# EAGLE design tqfp-sandwich-rf (EAGLE 9.6.2)

## Sheet 1 of 2
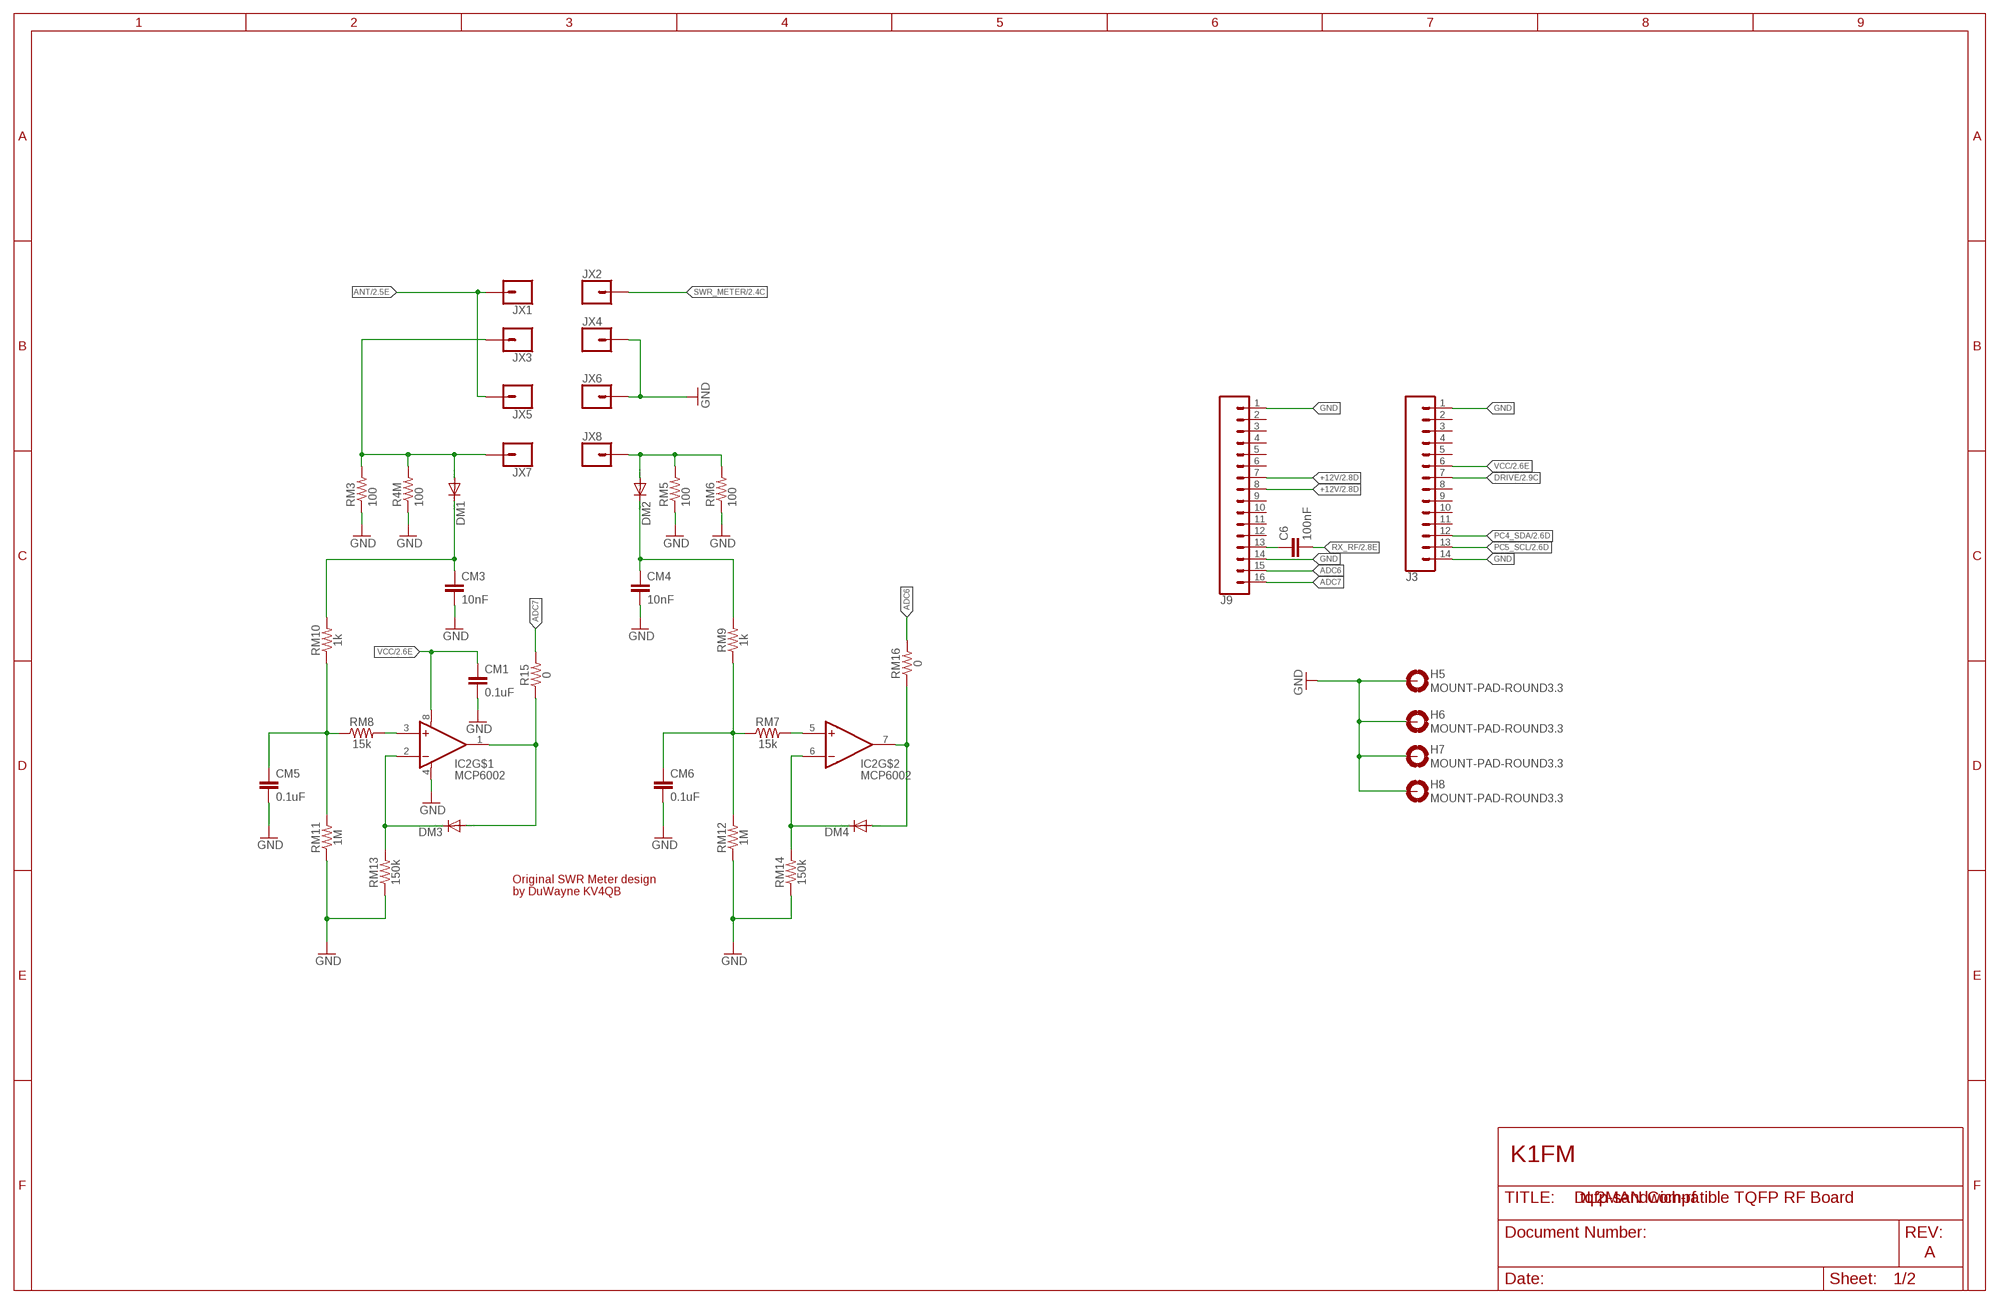
[diagram p0: schematic, sheet 1]

### Parts
C6  100nF  CAPACITOR_0805_L  [RESC0805_L]
CM1  0.1uF  0.1UF-0603-100V-10%  [0603]
CM3  10nF  10NF-0603-50V-10%  [0603]
CM4  10nF  10NF-0603-50V-10%  [0603]
CM5  0.1uF  0.1UF-0603-100V-10%  [0603]
CM6  0.1uF  0.1UF-0603-100V-10%  [0603]
DM1  1N60P  1N4148DO35-10  [DO35-10]
DM2  1N60P  1N4148DO35-10  [DO35-10]
DM3  1N60P  1N4148DO35-10  [DO35-10]
DM4  1N60P  1N4148DO35-10  [DO35-10]
H5  MOUNT-PAD-ROUND3.3  [3,3-PAD]
H6  MOUNT-PAD-ROUND3.3  [3,3-PAD]
H7  MOUNT-PAD-ROUND3.3  [3,3-PAD]
H8  MOUNT-PAD-ROUND3.3  [3,3-PAD]
IC2  MCP6002  MCP6293  [SOIC8]
J3  CONN_14  [1X14]
J9  CONN_16  [1X16]
JX1  CONN_01  [1X01]
JX2  CONN_01  [1X01]
JX3  CONN_01  [1X01]
JX4  CONN_01  [1X01]
JX5  CONN_01  [1X01]
JX6  CONN_01  [1X01]
JX7  CONN_01  [1X01]
JX8  CONN_01  [1X01]
R4M  100  R-US_M1206  [M1206]
R15  0  1KOHM-0603-1/10W-1%  [0603]
RM3  100  R-US_M1206  [M1206]
RM5  100  R-US_M1206  [M1206]
RM6  100  R-US_M1206  [M1206]
RM7  15k  15KOHM-0603-1/10W-1%  [0603]
RM8  15k  15KOHM-0603-1/10W-1%  [0603]
RM9  1k  1KOHM-0603-1/10W-1%  [0603]
RM10  1k  1KOHM-0603-1/10W-1%  [0603]
RM11  1M  1MOHM-0603-1/4W-5%  [0603]
RM12  1M  1MOHM-0603-1/4W-5%  [0603]
RM13  150k  150KOHM-0603-1/10W-1%  [0603]
RM14  150k  150KOHM-0603-1/10W-1%  [0603]
RM16  0  1KOHM-0603-1/10W-1%  [0603]

### Nets
+12V: J9.7 J9.8 ; also sheet 2
ADC6: J9.15 RM16.2
ADC7: J9.16 R15.2
ANT: JX1.1 JX5.1 ; also sheet 2
DRIVE: J3.7 ; also sheet 2
GND: CM1.2 CM3.2 CM4.2 CM5.2 CM6.2 H5.B3,3(MOUNT) H6.B3,3(MOUNT) H7.B3,3(MOUNT) H8.B3,3(MOUNT) IC2.4(V-) J3.1 J3.14 J9.1 J9.14 JX4.1 JX6.1 R4M.1 RM3.1 RM5.1 RM6.1 RM11.1 RM12.1 RM13.1 RM14.1 ; also sheet 2
N$5: DM3.A IC2.1(OUT) R15.1
N$6: DM4.A IC2.7(OUT) RM16.1
N$8: C6.1 J9.13
N$9: DM1.A JX3.1 JX7.1 R4M.2 RM3.2
N$10: DM2.A JX8.1 RM5.2 RM6.2
N$12: CM3.1 DM1.C RM10.2
N$13: CM4.1 DM2.C RM9.2
N$16: DM3.C IC2.2(-IN) RM13.2
N$17: DM4.C IC2.6(-IN) RM14.2
N$19: IC2.3(+IN) RM8.2
N$20: IC2.5(+IN) RM7.2
N$21: CM6.1 RM7.1 RM9.1 RM12.2
N$22: CM5.1 RM8.1 RM10.1 RM11.2
PC4_SDA: J3.12 ; also sheet 2
PC5_SCL: J3.13 ; also sheet 2
RX_RF: C6.2 ; also sheet 2
SWR_METER: JX2.1 ; also sheet 2
VCC: CM1.1 IC2.8(V+) J3.6 ; also sheet 2
Unconnected: J3.2 J3.3 J3.4 J3.5 J3.8 J3.9 J3.10 J3.11 J9.2 J9.3 J9.4 J9.5 J9.6 J9.9 J9.10 J9.11 J9.12

### Notes on the sheet
- Original SWR Meter design
  by DuWayne KV4QB
- K1FM
- DL2MAN Compatible TQFP RF Board
- A

## Sheet 2 of 2
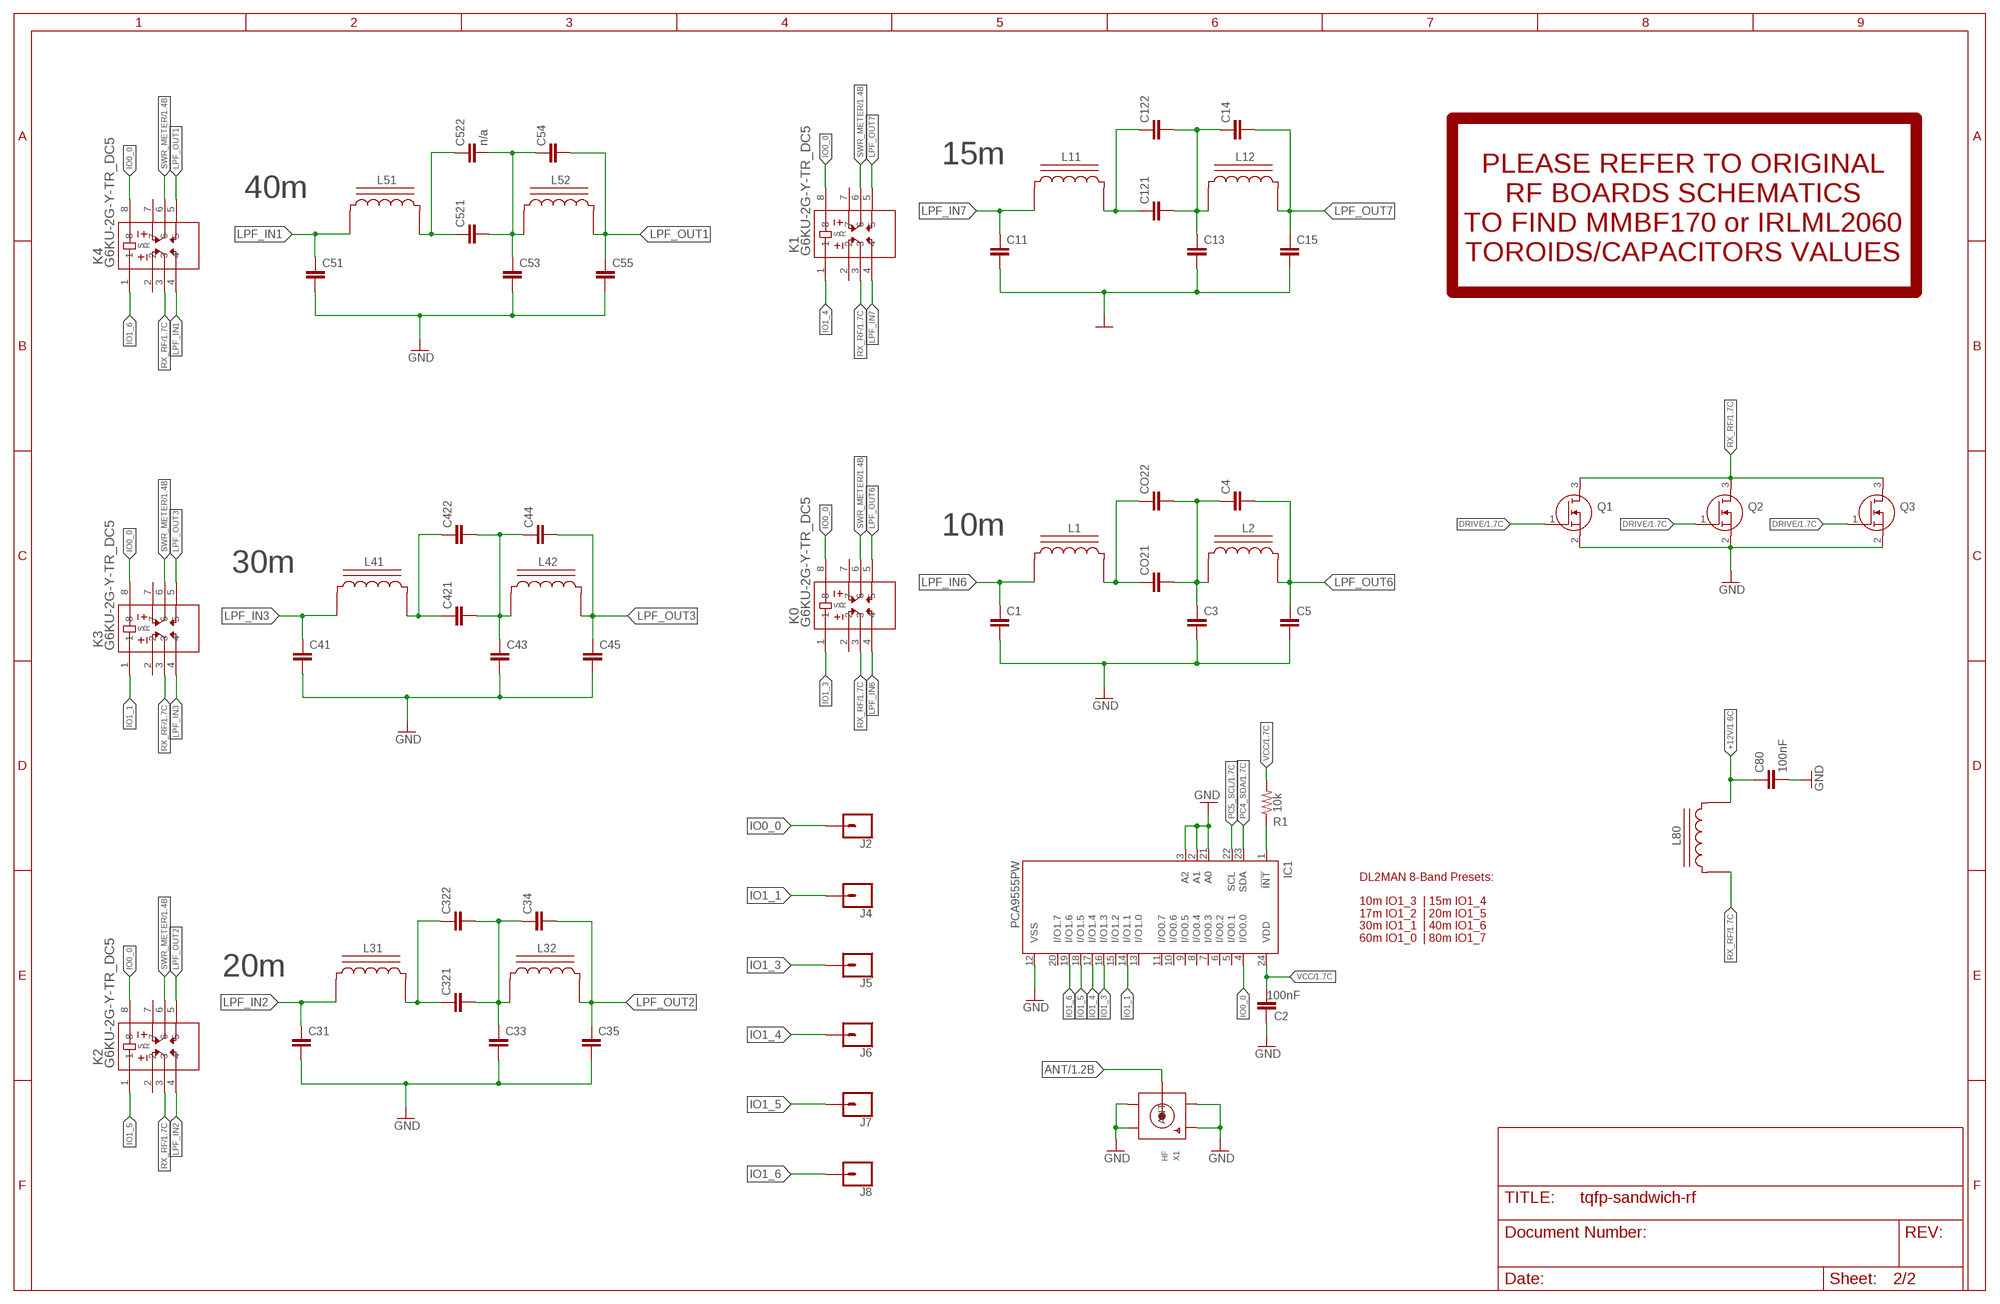
[diagram p1: schematic, sheet 2]

### Parts
C1  82pF  CAPACITOR_0805_L  [RESC0805_L]
C2  100nF  CAPACITOR_0805_L  [RESC0805_L]
C3  240pF  CAPACITOR_0805_L  [RESC0805_L]
C4  82pF  CAPACITOR_0805_L  [RESC0805_L]
C5  220pF  CAPACITOR_0805_L  [RESC0805_L]
C11  100pF  CAPACITOR_0805_L  [RESC0805_L]
C13  330pF  CAPACITOR_0805_L  [RESC0805_L]
C14  100pF  CAPACITOR_0805_L  [RESC0805_L]
C15  300pF  CAPACITOR_0805_L  [RESC0805_L]
C31  180pF  CAPACITOR_0805_L  [RESC0805_L]
C33  470pF  CAPACITOR_0805_L  [RESC0805_L]
C34  150pF  CAPACITOR_0805_L  [RESC0805_L]
C35  430pF  CAPACITOR_0805_L  [RESC0805_L]
C41  220pF  CAPACITOR_0805_L  [RESC0805_L]
C43  680pF  CAPACITOR_0805_L  [RESC0805_L]
C44  220pF  CAPACITOR_0805_L  [RESC0805_L]
C45  620pF  CAPACITOR_0805_L  [RESC0805_L]
C51  360pF  CAPACITOR_0805_L  [RESC0805_L]
C53  620pF+330pF  CAPACITOR_0805_L  [RESC0805_L]
C54  330pF  CAPACITOR_0805_L  [RESC0805_L]
C55  470pF+430pF  CAPACITOR_0805_L  [RESC0805_L]
C80  100nF  CAPACITOR_0805_L  [RESC0805_L]
C121  15pF  CAPACITOR_0805_L  [RESC0805_L]
C122  330pF  CAPACITOR_0805_L  [RESC0805_L]
C321  220pF  CAPACITOR_0805_L  [RESC0805_L]
C322  300pF  CAPACITOR_0805_L  [RESC0805_L]
C421  100pF  CAPACITOR_0805_L  [RESC0805_L]
C422  620pF  CAPACITOR_0805_L  [RESC0805_L]
C521  1000pF  CAPACITOR_0805_L  [RESC0805_L]
C522  n/a  CAPACITOR_0805_L  [RESC0805_L]
CO21  56pF  CAPACITOR_0805_L  [RESC0805_L]
CO22  200pF  CAPACITOR_0805_L  [RESC0805_L]
IC1  PCA9555PW  [TSSOP24]
J2  CONN_01OFFSET  [1X01_OFFSET]
J4  CONN_01OFFSET  [1X01_OFFSET]
J5  CONN_01OFFSET  [1X01_OFFSET]
J6  CONN_01OFFSET  [1X01_OFFSET]
J7  CONN_01OFFSET  [1X01_OFFSET]
J8  CONN_01OFFSET  [1X01_OFFSET]
K0  G6KU-2G-Y-TR_DC5  [G6KU-2G-Y_DC3_OMR]
K1  G6KU-2G-Y-TR_DC5  [G6KU-2G-Y_DC3_OMR]
K2  G6KU-2G-Y-TR_DC5  [G6KU-2G-Y_DC3_OMR]
K3  G6KU-2G-Y-TR_DC5  [G6KU-2G-Y_DC3_OMR]
K4  G6KU-2G-Y-TR_DC5  [G6KU-2G-Y_DC3_OMR]
L1  8T/T37-6  T37_INDUCTOR  [T37_INDUCTOR]
L2  5T/T37-6  T37_INDUCTOR  [T37_INDUCTOR]
L11  9T/T37-6  T37_INDUCTOR  [T37_INDUCTOR]
L12  6T/T37-6  T37_INDUCTOR  [T37_INDUCTOR]
L31  12T/T37-6  T37_INDUCTOR  [T37_INDUCTOR]
L32  8T/T37-2  T37_INDUCTOR  [T37_INDUCTOR]
L41  12T/T37-2  T37_INDUCTOR  [T37_INDUCTOR]
L42  8T/T37-2  T37_INDUCTOR  [T37_INDUCTOR]
L51  15T/T37-2  T37_INDUCTOR  [T37_INDUCTOR]
L52  9T/T37-2  T37_INDUCTOR  [T37_INDUCTOR]
L80  12T/FT37-43  T37_INDUCTOR  [T37_INDUCTOR]
Q1  MMBF170  [SOT96P237X111-3N]
Q2  MMBF170  [SOT96P237X111-3N]
Q3  MMBF170  [SOT96P237X111-3N]
R1  10k  10KOHM-0603-1/10W-1%  [0603]
X1  HF  SMACONNECTOR_EDGE  [SMA_EDGELAUNCH]

### Nets
+12V: C80.1 L80.CA ; also sheet 1
ANT: X1.P(ANT) ; also sheet 1
DRIVE: Q1.1(G) Q2.1(G) Q3.1(G) ; also sheet 1
GND: C1.2 C2.1 C3.2 C5.2 C11.2 C13.2 C15.2 C31.2 C33.2 C35.2 C41.2 C43.2 C45.2 C51.2 C53.2 C55.2 C80.2 IC1.2(A1) IC1.3(A2) IC1.12(VSS) IC1.21(A0) Q1.2(S) Q2.2(S) Q3.2(S) X1.GND@1(GND4) X1.GND@2(GND3) X1.GND@3(GND2) X1.GND@4(GND1) ; also sheet 1
IO0_0: IC1.4(I/O0.0) J2.1 K0.8 K1.8 K2.8 K3.8 K4.8
IO1_1: IC1.14(I/O1.1) J4.1 K3.1
IO1_3: IC1.16(I/O1.3) J5.1 K0.1
IO1_4: IC1.17(I/O1.4) J6.1 K1.1
IO1_5: IC1.18(I/O1.5) J7.1 K2.1
IO1_6: IC1.19(I/O1.6) J8.1 K4.1
LPF_IN1: C51.1 K4.4 L51.CB
LPF_IN2: C31.1 K2.4 L31.CB
LPF_IN3: C41.1 K3.4 L41.CB
LPF_IN6: C1.1 K0.4 L1.CB
LPF_IN7: C11.1 K1.4 L11.CB
LPF_OUT1: C54.2 C55.1 K4.5 L52.CA
LPF_OUT2: C34.2 C35.1 K2.5 L32.CA
LPF_OUT3: C44.2 C45.1 K3.5 L42.CA
LPF_OUT6: C4.2 C5.1 K0.5 L2.CA
LPF_OUT7: C14.2 C15.1 K1.5 L12.CA
N$1: CO21.1 CO22.1 L1.CA
N$2: C3.1 C4.1 CO21.2 CO22.2 L2.CB
N$3: C121.1 C122.1 L11.CA
N$4: C13.1 C14.1 C121.2 C122.2 L12.CB
N$7: IC1.1(!INT) R1.1
N$11: C421.1 C422.1 L41.CA
N$23: C43.1 C44.1 C421.2 C422.2 L42.CB
N$27: C321.1 C322.1 L31.CA
N$28: C33.1 C34.1 C321.2 C322.2 L32.CB
N$49: C521.1 C522.1 L51.CA
N$50: C53.1 C54.1 C521.2 C522.2 L52.CB
PC4_SDA: IC1.23(SDA) ; also sheet 1
PC5_SCL: IC1.22(SCL) ; also sheet 1
RX_RF: K0.3 K1.3 K2.3 K3.3 K4.3 L80.CB Q1.3(D) Q2.3(D) Q3.3(D) ; also sheet 1
SWR_METER: K0.6 K1.6 K2.6 K3.6 K4.6 ; also sheet 1
VCC: C2.2 IC1.24(VDD) R1.2 ; also sheet 1
Unconnected: IC1.5(I/O0.1) IC1.6(I/O0.2) IC1.7(I/O0.3) IC1.8(I/O0.4) IC1.9(I/O0.5) IC1.10(I/O0.6) IC1.11(I/O0.7) IC1.13(I/O1.0) IC1.15(I/O1.2) IC1.20(I/O1.7) K0.2 K0.7 K1.2 K1.7 K2.2 K2.7 K3.2 K3.7 K4.2 K4.7

### Notes on the sheet
- 15m
- 40m
- PLEASE REFER TO ORIGINAL
  RF BOARDS SCHEMATICS
  TO FIND MMBF170 or IRLML2060
  TOROIDS/CAPACITORS VALUES
- 10m
- 30m
- DL2MAN 8-Band Presets:
  
  10m IO1_3  | 15m IO1_4
  17m IO1_2  | 20m IO1_5
  30m IO1_1  | 40m IO1_6
  60m IO1_0  | 80m IO1_7
- 20m

## Library data of the parts
C1-C6 C11 C13-C15 C31 C33-C35 C41 C43-C45 C51 C53-C55 C80 C121 C122 C321 C322 C421 C422 C521 C522 CO21 CO22 = Nordic_nRF:CAPACITOR: Generic chip capacitor
CM1 CM5 CM6 = SparkFun-Capacitors:0.1UF: 0.1µF ceramic capacitors A capacitor is a passive two-terminal electrical component used to store electrical energy temporarily in an electric field.; PROD_ID: CAP-08390
CM3 CM4 = SparkFun-Capacitors:10NF: 0.01uF/10nF/10,000pF ceramic capacitors A capacitor is a passive two-terminal electrical component used to store electrical energy temporarily in an electric field. CAP-09321; PROD_ID: CAP-00867
DM1-DM4 = diode:1N4148: DIODE high speed (Philips)
H5-H8 = holes:MOUNT-PAD-ROUND: MOUNTING PAD, round
IC1 = micro-philips:PCA9555: 16-bit I2C and SMBus I/O port with interrupt Source: PCA9555_5.pdf
IC2 = adam - ics:MCP6293
J2 J4-J8 JX1-JX8 = SparkFun-Connectors:CONN_01: Single connection point. Often used as Generic Header-pin footprint for 0.1 inch spaced/style header connections On any of the 0.1 inch spaced packages, you can populate with these: Break Away Headers - Straight <https://www.sparkfun.com/products/116> (PRT-00116) Break Away Male Headers - Right Angle <https://www.sparkfun.com/products/553> (PRT-00553) Female Headers <https://www.sparkfun.com/products/115> (PRT-00115) Break Away Headers - Machine Pin <https://www.sparkfun.com/products/117> (PRT-00117) Break Away Female Headers - Swiss Machine Pin <https://www.sparkfun.com/products/743> (PRT-00743) This device is also useful as a general connection point to wire up your design to another part of your project. Our various solder wires solder well into these plated through hole pads. Hook-Up Wire - Assortment (Stranded, 22 AWG) <https://www.sparkfun.com/products/11375> (PRT-11375) Hook-Up Wire - Assortment (Solid Core, 22 AWG) <https://www.sparkfun.com/products/11367> (PRT-11367) View the entire wire category on our website here <https://www.sparkfun.com/categories/141> Special notes: SMTSO-256-ET is a "flush mount" nut for a 4-40 screw. We mostly use this on specialty testbeds; it is a nice way to connect hardware to your PCB at an adjustable hieght. Also note, the SNAP packages are for using a snappable style connector. We sell a baggie of snaps and they are also used on two LilyPad designs: Snap Assortment - 30 pack (male and female) <https://www.sparkfun.com/products/11347> (DEV-11347) LilyPad Arduino SimpleSnap <https://www.sparkfun.com/products/10941> (DEV-10941) LilyPad SimpleSnap Protoboard <https://www.sparkfun.com/products/10940> (DEV-10940)
J3 = SparkFun-Connectors:CONN_14: Multi connection point. Often used as Generic Header-pin footprint for 0.1 inch spaced/style header connections On any of the 0.1 inch spaced packages, you can populate with these: Break Away Headers - Straight <https://www.sparkfun.com/products/116> (PRT-00116) Break Away Male Headers - Right Angle <https://www.sparkfun.com/products/553> (PRT-00553) Female Headers <https://www.sparkfun.com/products/115> (PRT-00115) Break Away Headers - Machine Pin <https://www.sparkfun.com/products/117> (PRT-00117) Break Away Female Headers - Swiss Machine Pin <https://www.sparkfun.com/products/743> (PRT-00743) For SCREWTERMINALS and SPRING TERMINALS visit here: Screw Terimnals on SparkFun.com <https://www.sparkfun.com/search/results?term=Screw+Terminals> (5mm/3.5mm/2.54mm spacing) This device is also useful as a general connection point to wire up your design to another part of your project. Our various solder wires solder well into these plated through hole pads. Hook-Up Wire - Assortment (Stranded, 22 AWG) <https://www.sparkfun.com/products/11375> (PRT-11375) Hook-Up Wire - Assortment (Solid Core, 22 AWG) <https://www.sparkfun.com/products/11367> (PRT-11367) View the entire wire category on our website here <https://www.sparkfun.com/categories/141> Special notes: Molex polarized connector foot print use with SKU : PRT-08231 with associated crimp pins and housings. 1MM SMD Version SKU: PRT-10208 NOTES ON THE VARIANTS LOCK and LOCK_LONGPADS... This footprint was designed to help hold the alignment of a through-hole component (i.e. 6-pin header) while soldering it into place. You may notice that each hole has been shifted either up or down by 0.005 of an inch from it's more standard position (which is a perfectly straight line). This slight alteration caused the pins (the squares in the middle) to touch the edges of the holes. Because they are alternating, it causes a "brace" to hold the component in place. 0.005 has proven to be the perfect amount of "off-center" position when using our standard breakaway headers. Although looks a little odd when you look at the bare footprint, once you have a header in there, the alteration is very hard to notice. Also,if you push a header all the way into place, it is covered up entirely on the bottom side.
J9 = SparkFun-Connectors:CONN_16: Multi connection point. Often used as Generic Header-pin footprint for 0.1 inch spaced/style header connections On any of the 0.1 inch spaced packages, you can populate with these: Break Away Headers - Straight <https://www.sparkfun.com/products/116> (PRT-00116) Break Away Male Headers - Right Angle <https://www.sparkfun.com/products/553> (PRT-00553) Female Headers <https://www.sparkfun.com/products/115> (PRT-00115) Break Away Headers - Machine Pin <https://www.sparkfun.com/products/117> (PRT-00117) Break Away Female Headers - Swiss Machine Pin <https://www.sparkfun.com/products/743> (PRT-00743) For SCREWTERMINALS and SPRING TERMINALS visit here: Screw Terimnals on SparkFun.com <https://www.sparkfun.com/search/results?term=Screw+Terminals> (5mm/3.5mm/2.54mm spacing) This device is also useful as a general connection point to wire up your design to another part of your project. Our various solder wires solder well into these plated through hole pads. Hook-Up Wire - Assortment (Stranded, 22 AWG) <https://www.sparkfun.com/products/11375> (PRT-11375) Hook-Up Wire - Assortment (Solid Core, 22 AWG) <https://www.sparkfun.com/products/11367> (PRT-11367) View the entire wire category on our website here <https://www.sparkfun.com/categories/141> Special notes: Molex polarized connector foot print use with SKU : PRT-08231 with associated crimp pins and housings. 1MM SMD Version SKU: PRT-10208 NOTES ON THE VARIANTS LOCK and LOCK_LONGPADS... This footprint was designed to help hold the alignment of a through-hole component (i.e. 6-pin header) while soldering it into place. You may notice that each hole has been shifted either up or down by 0.005 of an inch from it's more standard position (which is a perfectly straight line). This slight alteration caused the pins (the squares in the middle) to touch the edges of the holes. Because they are alternating, it causes a "brace" to hold the component in place. 0.005 has proven to be the perfect amount of "off-center" position when using our standard breakaway headers. Although looks a little odd when you look at the bare footprint, once you have a header in there, the alteration is very hard to notice. Also,if you push a header all the way into place, it is covered up entirely on the bottom side.
K0 K1-K4 = G6KU-2G-Y-TR:G6KU-2G-Y-TR_DC5; BUILT_BY: EMA_Justin; COPYRIGHT: Copyright (C) 2018 Accelerated Designs. All rights reserved; MANUFACTURER_PART_NUMBER: G6KU-2G-Y-TR DC5; SOURCELIBRARY: Omron_2020-03-12; VENDOR: Omron
L1 L2 L11 L12 L31 L32 L41 L42 L51 L52 L80 = toroid:T37_INDUCTOR: Inductor wound on a T37 Toroid
Q1-Q3 = MMBF170:MMBF170: MMBF170 N-Channel MOSFET, 500 mA, 60 V, 3-Pin SOT-23 ON Semiconductor Source: Datasheet <https://www.onsemi.com/pub/Collateral/MMBF170-D.PDF>; DESCRIPTION: MMBF170 N-Channel MOSFET, 500 mA, 60 V, 3-Pin SOT-23 ON Semiconductor; HEIGHT: 1.11mm; MANUFACTURER_NAME: ON Semiconductor; MANUFACTURER_PART_NUMBER: MMBF170; MOUSER_PART_NUMBER: 512-MMBF170; MOUSER_PRICE-STOCK: https://www.mouser.co.uk/ProductDetail/ON-Semiconductor-Fairchild/MMBF170?qs=FOlmdCx%252BAA2suHItufvdcg%3D%3D
R1 = SparkFun-Resistors:10KOHM: 10kΩ resistor A resistor is a passive two-terminal electrical component that implements electrical resistance as a circuit element. Resistors act to reduce current flow, and, at the same time, act to lower voltage levels within circuits. - Wikipedia; PROD_ID: RES-00824
R4M RM3 RM5 RM6 = rcl:R-US_: RESISTOR, American symbol; SPICEPREFIX: R
R15 RM16 = SparkFun-Resistors:1KOHM: 1kΩ resistor A resistor is a passive two-terminal electrical component that implements electrical resistance as a circuit element. Resistors act to reduce current flow, and, at the same time, act to lower voltage levels within circuits. - Wikipedia; PROD_ID: RES-07856; VALUE: 1k
RM7 RM8 = SparkFun-Resistors:15KOHM: 15kΩ resistor A resistor is a passive two-terminal electrical component that implements electrical resistance as a circuit element. Resistors act to reduce current flow, and, at the same time, act to lower voltage levels within circuits. - Wikipedia; PROD_ID: RES-07854
RM9 RM10 = SparkFun-Resistors:1KOHM: 1kΩ resistor A resistor is a passive two-terminal electrical component that implements electrical resistance as a circuit element. Resistors act to reduce current flow, and, at the same time, act to lower voltage levels within circuits. - Wikipedia; PROD_ID: RES-07856
RM11 RM12 = SparkFun-Resistors:1MOHM: 1MΩ resistor A resistor is a passive two-terminal electrical component that implements electrical resistance as a circuit element. Resistors act to reduce current flow, and, at the same time, act to lower voltage levels within circuits. - Wikipedia; PROD_ID: RES-07868
RM13 RM14 = SparkFun-Resistors:150KOHM: 150kΩ resistor A resistor is a passive two-terminal electrical component that implements electrical resistance as a circuit element. Resistors act to reduce current flow, and, at the same time, act to lower voltage levels within circuits. - Wikipedia; PROD_ID: RES-09117
X1 = adafruit:SMACONNECTOR: SMA Connector 90° DIP SMA Connector, 50 Ohm (4UConnector: 07259)

## Net classes
1 larger: width 0.406 mm, drill 0.35 mm

## Board
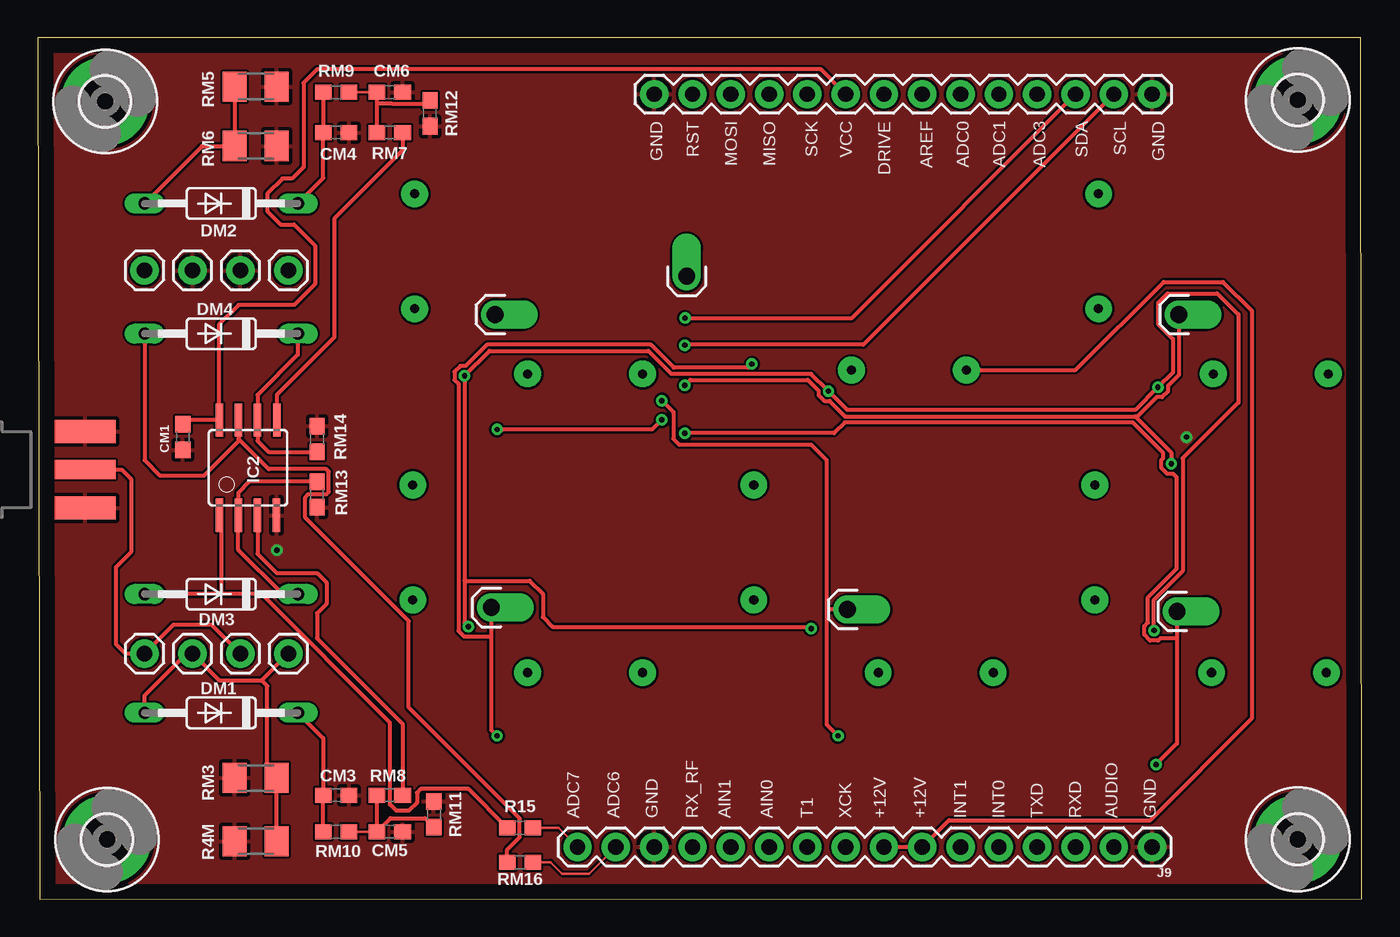
[diagram p2: board, top side]
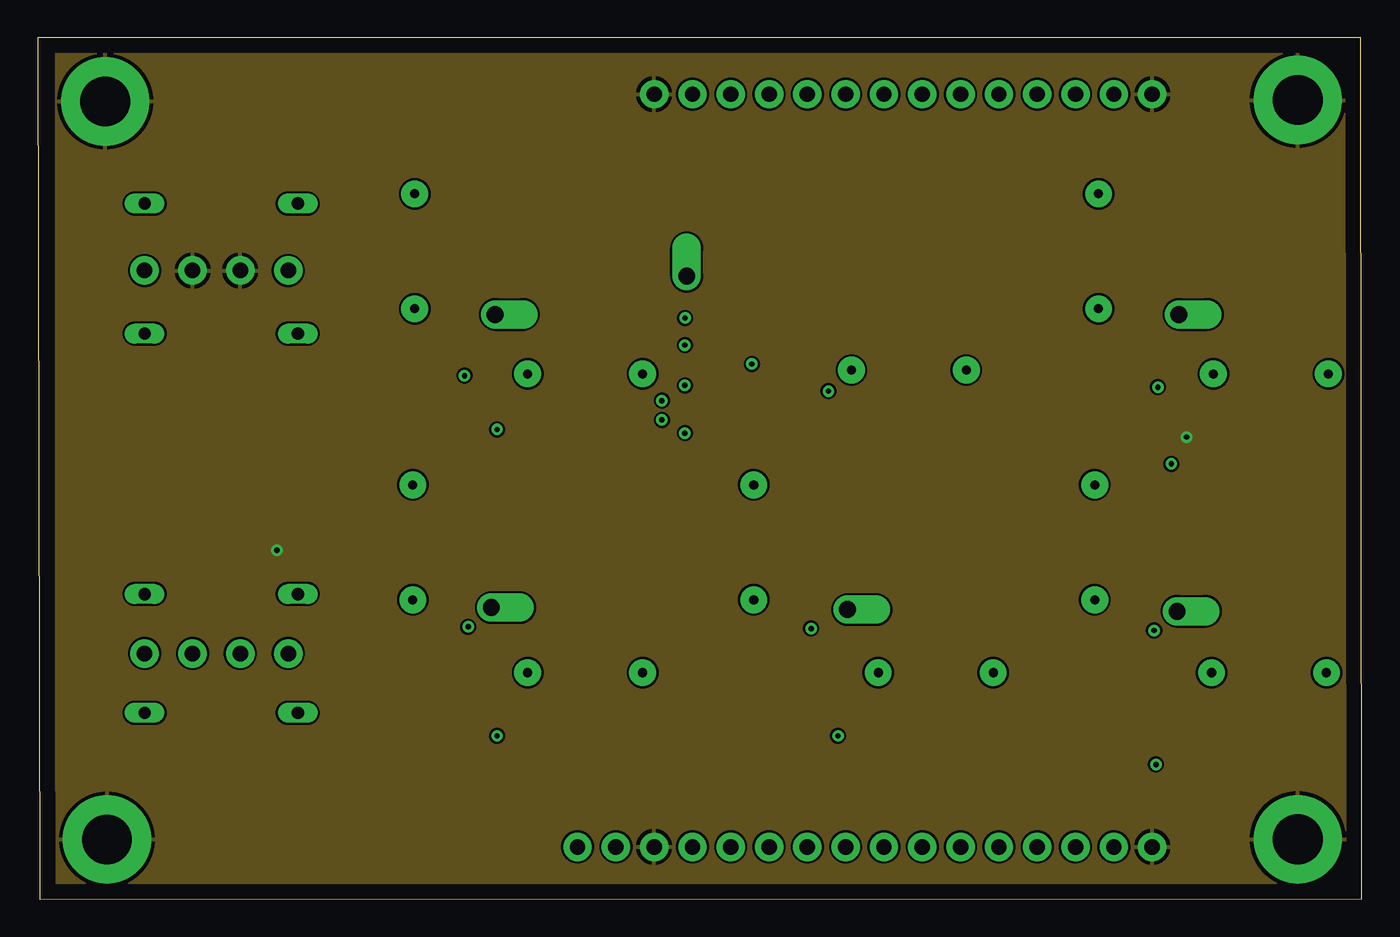
[diagram p3: board, inner layer Route2]
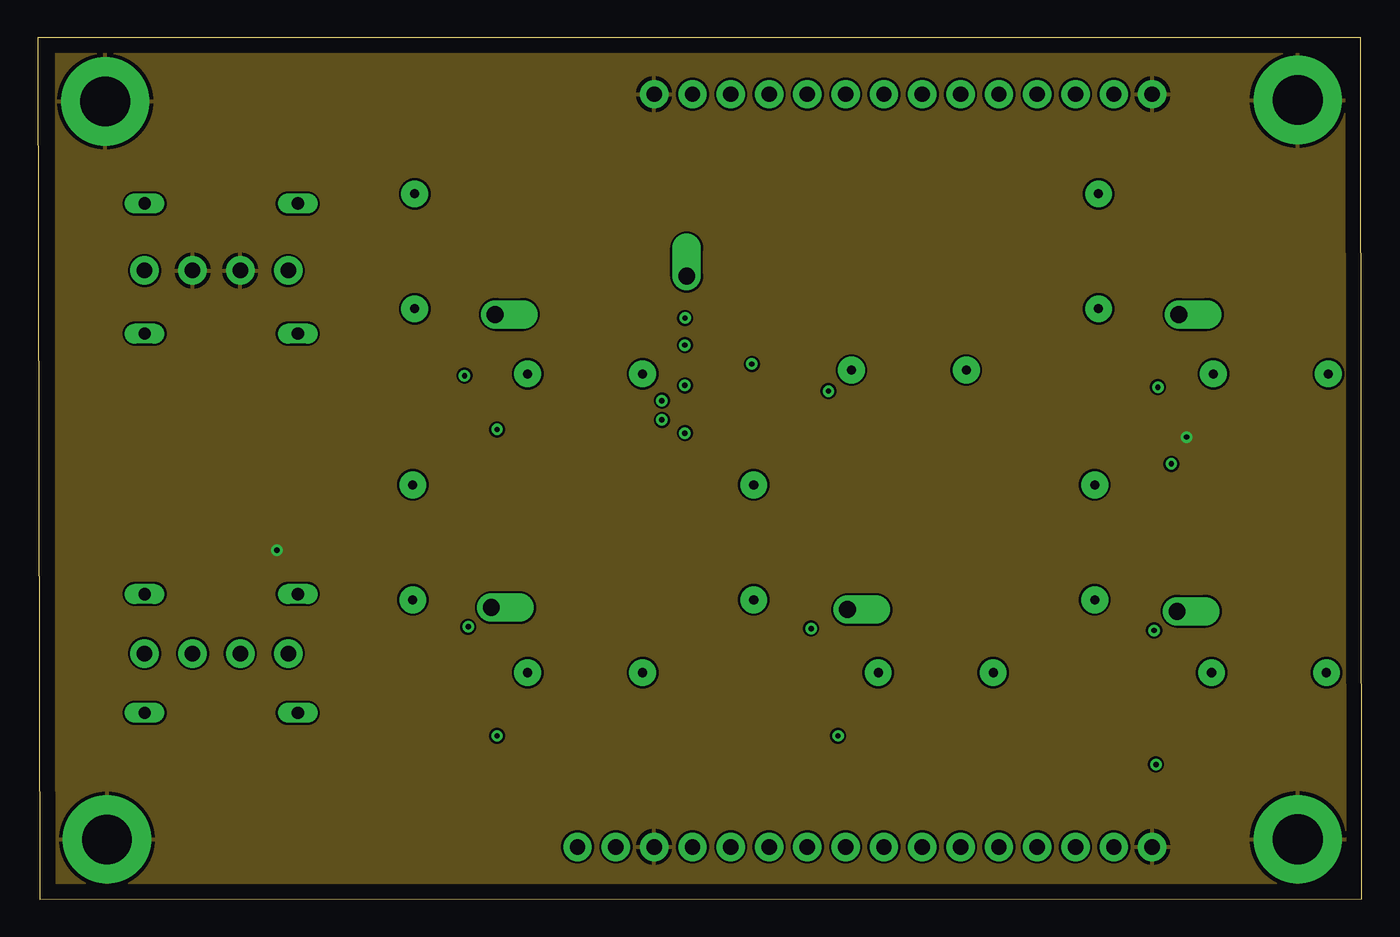
[diagram p4: board, inner layer Route15]
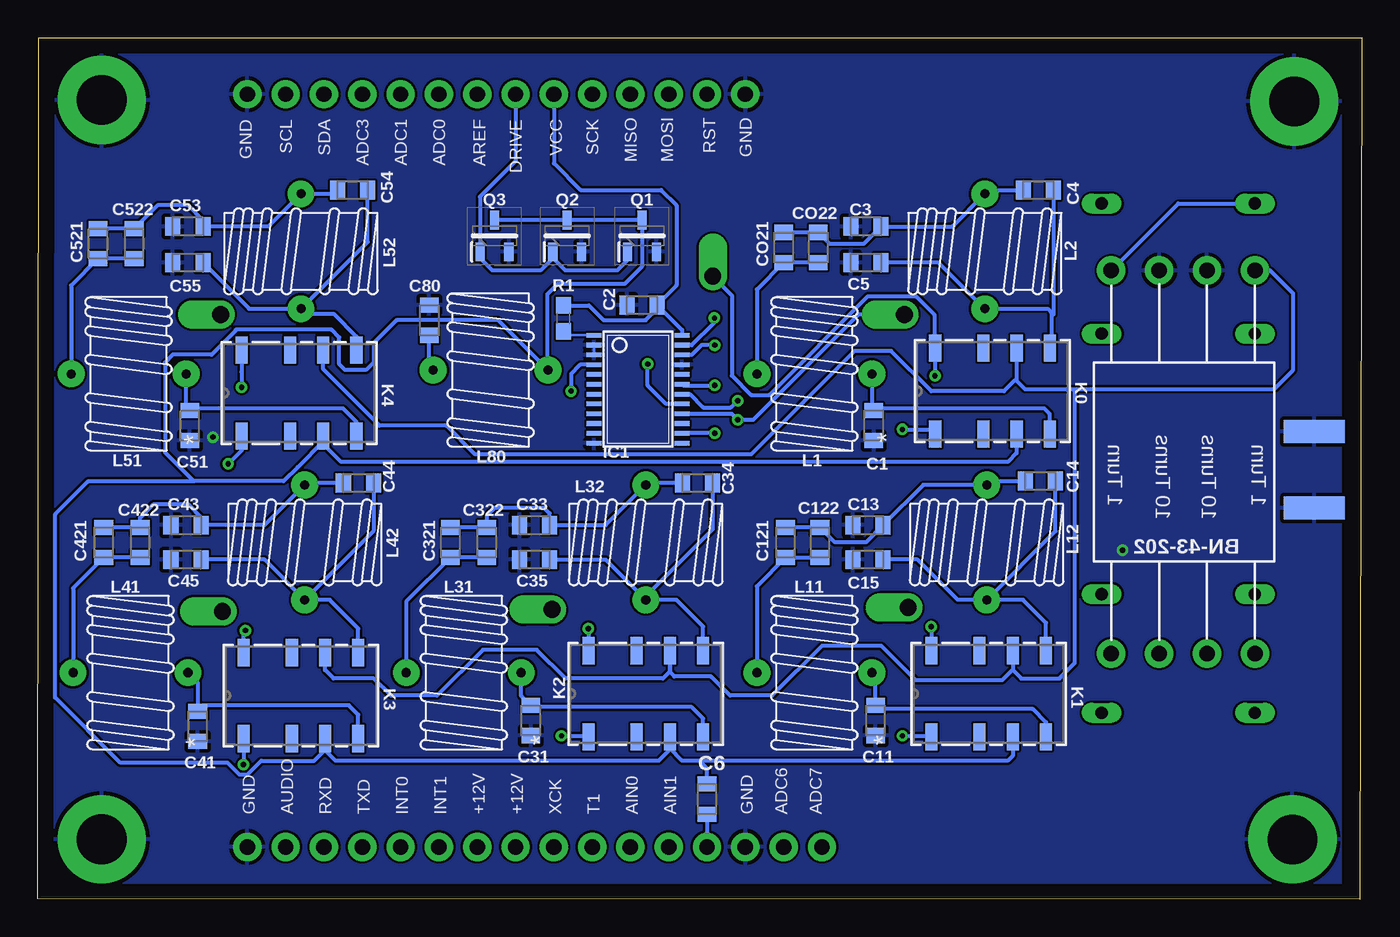
[diagram p5: board, bottom side, seen from below]

Size 87.79 x 57.13 mm. Coordinates in mm from the lower left corner, seen from the top.
Outline: 0.15,0 87.79,0.04 87.73,57.13 0,57.11 0.15,0
Copper layers (1*16): Top 0.035mm / dielectric 1.5mm / Bottom 0.035mm
Design rules "default *": minimum track width 6mil, minimum drill 0.35mm, track to track 6mil, track to pad 6mil, pad to pad 6mil, via to via 6mil, smd to smd 6mil, copper to edge 40mil, drill to drill 6mil, minimum pad ring 10mil, minimum via ring 8mil, stop-mask expansion 4mil, vias tented up to drill 0mil, thermal gap 10mil

### Footprints (pad centres in the part's own frame; a part is rotated, then mirrored left to right if it is on the bottom)
RESC0805_L = smd 1 x 1.25: 1 -1,0; 2 1,0
0603 = smd 1.1 x 1: 1 -0.85,0; 2 0.85,0
DO35-10 = drill 0.813 long: A 5.08,0; C -5.08,0
3,3-PAD = drill 3.3 pad 5.842: B3,3 0,0
TSSOP24 = smd 0.305 x 0.991: 1 -3.575,-2.918; 2 -2.925,-2.918; 3 -2.275,-2.918; 4 -1.625,-2.918; 5 -0.975,-2.918; 6 -0.325,-2.918; 7 0.325,-2.918; 8 0.975,-2.918; 9 1.625,-2.918; 10 2.275,-2.918; 11 2.925,-2.918; 12 3.575,-2.918; 13 3.575,2.918; 14 2.925,2.918; 15 2.275,2.918; 16 1.625,2.918; 17 0.975,2.918; 18 0.325,2.918; 19 -0.325,2.918; 20 -0.975,2.918; 21 -1.625,2.918; 22 -2.275,2.918; 23 -2.925,2.918; 24 -3.575,2.918
SOIC8 = smd 0.5 x 2.2: 1 -1.905,-3.154; 2 -0.645,-3.154; 3 0.625,-3.154; 4 1.895,-3.154; 5 1.905,3.154; 6 0.635,3.154; 7 -0.635,3.154; 8 -1.905,3.154
1X01_OFFSET = drill 1.118 pad 1.88 offset: 1 0,0
1X14 = drill 1.016 pad 1.88: 1 0,0; 2 2.54,0; 3 5.08,0; 4 7.62,0; 5 10.16,0; 6 12.7,0; 7 15.24,0; 8 17.78,0; 9 20.32,0; 10 22.86,0; 11 25.4,0; 12 27.94,0; 13 30.48,0; 14 33.02,0
1X16 = drill 1.016 pad 1.88: 1 0,0; 2 2.54,0; 3 5.08,0; 4 7.62,0; 5 10.16,0; 6 12.7,0; 7 15.24,0; 8 17.78,0; 9 20.32,0; 10 22.86,0; 11 25.4,0; 12 27.94,0; 13 30.48,0; 14 33.02,0; 15 35.56,0; 16 38.1,0
1X01 = drill 1.016 pad 1.88: 1 0,0
G6KU-2G-Y_DC3_OMR = smd 1.8 x 0.8: 1 -2.85,3.8; 2 -2.85,0.6; 3 -2.85,-1.6; 4 -2.85,-3.8; 5 2.85,-3.8; 6 2.85,-1.6; 7 2.85,0.6; 8 2.85,3.8
T37_INDUCTOR = drill 0.6 pad 1.778: CA -3.81,0; CB 3.81,0
SOT96P237X111-3N = smd 1.25 x 0.6: 1 -1.05,0.955; 2 -1.05,-0.955; 3 1.05,0
M1206 = smd 1.6 x 2: 1 -1.4,0; 2 1.4,0
SMA_EDGELAUNCH = smd 4.064 x 1.524: GND@1 2.032,-2.54; GND@2 2.032,2.54 | smd 4.064 x 1.524 bottom: GND@3 2.032,2.54; GND@4 2.032,-2.54 | smd 4.064 x 1.27: P 2.032,0

### Placement (x,y rotation side)
C1  32.36,31.41 270 bottom
C2  47.73,39.41 0 bottom
C3  32.87,44.61 180 bottom
C4  21.44,47.03 0 bottom
C5  32.87,42.2 180 bottom
C6  43.41,6.64 90 bottom
C11  32.23,11.85 270 bottom
C13  32.74,24.8 180 bottom
C14  21.31,27.72 0 bottom
C15  32.74,22.52 180 bottom
C31  55.09,11.85 270 bottom
C33  54.84,24.8 180 bottom
C34  44.04,27.6 0 bottom
C35  54.84,22.52 180 bottom
C41  77.19,11.47 270 bottom
C43  77.95,24.8 180 bottom
C44  66.52,27.6 0 bottom
C45  77.95,22.52 180 bottom
C51  77.7,31.41 270 bottom
C53  77.83,44.61 180 bottom
C54  66.9,47.03 0 bottom
C55  77.83,42.2 180 bottom
C80  61.82,38.39 90 bottom
C121  38.2,23.66 90 bottom
C122  35.92,23.66 90 bottom
C321  60.43,23.66 90 bottom
C322  58.01,23.66 90 bottom
C421  83.41,23.66 90 bottom
C422  81,23.66 90 bottom
C521  83.79,43.47 90 bottom
C522  81.38,43.47 90 bottom
CM1  9.63,30.64 270 top
CM3  19.79,6.89 0 top
CM4  19.79,50.84 0 top
CM5  23.34,4.48 0 top
CM6  23.34,53.5 0 top
CO21  38.33,43.22 90 bottom
CO22  36.04,43.22 90 bottom
DM1  12.17,12.36 180 top
DM2  12.17,46.14 180 top
DM3  12.17,20.23 180 top
DM4  12.17,37.5 180 top
H5  4.47,52.9 0 top
H6  83.54,53 0 top
H7  4.6,3.96 0 top
H8  83.54,3.97 0 top
IC1  47.98,33.82 270 bottom
IC2  13.94,28.61 0 top
J2  43.03,41.31 0 top
J3  40.87,53.38 0 top
J4  75.54,19.09 270 top
J5  30.33,38.77 270 top
J6  30.07,19.34 270 top
J7  53.7,19.21 270 top
J8  75.67,38.77 270 top
J9  73.89,3.47 180 top
JX1  7.09,16.29 0 top
JX2  7.09,41.69 0 top
JX3  10.26,16.29 0 top
JX4  10.26,41.69 0 top
JX5  13.44,16.29 0 top
JX6  13.44,41.69 0 top
JX7  16.61,16.29 0 top
JX8  16.61,41.69 0 top
K0  24.49,33.69 90 bottom
K1  24.74,13.63 90 bottom
K2  47.47,13.63 90 bottom
K3  70.33,13.5 90 bottom
K4  70.46,33.56 90 bottom
L1  36.3,34.83 0 bottom
L2  24.99,42.96 90 bottom
L11  36.3,15.02 0 bottom
L12  24.87,23.66 90 bottom
L31  59.54,15.02 0 bottom
L32  47.47,23.66 90 bottom
L41  81.64,15.02 0 bottom
L42  70.08,23.66 90 bottom
L51  81.76,34.83 0 bottom
L52  70.33,42.96 90 bottom
L80  57.76,35.09 0 bottom
Q1  47.73,43.98 90 bottom
Q2  52.68,43.98 90 bottom
Q3  57.51,43.98 90 bottom
R1  52.93,38.52 90 bottom
R4M  14.45,3.85 0 top
R15  31.98,4.74 0 top
RM3  14.45,8.04 0 top
RM5  14.45,53.88 180 top
RM6  14.45,49.95 180 top
RM7  23.34,50.84 0 top
RM8  23.34,6.89 0 top
RM9  19.79,53.5 180 top
RM10  19.79,4.48 180 top
RM11  26.26,5.62 270 top
RM12  26.01,52.11 90 top
RM13  18.52,26.83 90 top
RM14  18.52,30.52 270 top
RM16  31.98,2.45 0 top
X1  1.12,28.48 0 top

### Tracks (layer width: path | path; a pad name or v marks a point on that pad's centre or on a via)
+12V
  Top 0.254: J9.8 J9.7 60.43,5.24 73.76,5.24 80.49,11.97 80.49,39.03 78.59,40.93 74.65,40.93 68.81,35.09 L80.CA
  Bottom 0.254: L80.CA 61.82,35.34 C80.1
ADC6
  Top 0.152: RM16.2 34.01,2.45 34.77,1.69 36.55,1.69 J9.15
ADC7
  Top 0.152: R15.2 34.52,4.74 J9.16
ANT
  Top 0.254: JX5.1 11.53,18.2 8.99,18.2 JX1.1 5.82,16.29 5.18,16.93 5.18,22.01 6.2,23.02 6.2,27.85 5.56,28.48 X1.P
DRIVE
  Bottom 0.254: J3.7 56.11,48.93 58.46,46.58 Q3.1 58.46,42.52 57.63,41.69 54.46,41.69 53.63,42.52 Q2.1 53.63,42.52 52.81,41.69 49.38,41.69 48.68,42.39 Q1.1
GND  (via drill 0.35)
  Bottom 0.152: IC1.2 IC1.3
  other vias: 76.17,30.64 15.85,23.15
  pour Bottom: 1.4,56.63 86.94,56.63 86.94,0.16 1.4,0.16
  pour Route2: 1.24,56.68 86.84,56.68 86.84,0.16 1.24,0.16
  pour Route15: 1.24,56.68 87.1,56.68 87.1,0.29 1.24,0.29
  pour Top: 0.74,56.68 87.1,56.68 87.1,0.8 0.74,0.8
IO0_0  (via drill 0.35)
  Top 0.254: 28.3,21.12 v28.3,34.71 29.95,36.36 40.49,36.36 41.27,35.57 42.01,34.83 51.28,34.83 v52.43,33.69 53.67,32.45 72.77,32.45 v74.27,33.95 75.26,34.94 75.26,37.15 74.27,38.14 74.27,39.53 74.9,40.17 78.21,40.17 79.6,38.77 79.6,32.93 75.92,29.25 75.92,21.75 74.02,19.85 v74.02,17.82 | 28.3,21.12 28.3,18.32 v28.55,18.07 | v51.28,17.94 51.16,18.07 34.14,18.07 33.5,18.71 33.5,20.23 32.61,21.12 28.3,21.12
  Bottom 0.254: v28.3,34.71 28.29,34.72 K0.8 28.35,36.6 28.35,38.77 29.57,39.99 32.73,39.99 39.28,33.44 40.49,33.44 41.76,34.71 41.76,40.04 J2.1 | v28.55,18.07 28.55,16.49 K1.8 | v51.28,17.94 K2.8 | K3.8 74.13,17.7 v74.02,17.82 | K4.8 74.26,34.97 74.27,34.96 v74.27,33.95 | IC1.4 51.82,35.44 52.43,34.83 v52.43,33.69
IO1_1  (via drill 0.35)
  Top 0.254: v42.9,30.9 52.81,30.9 53.52,31.61 72.6,31.61 74.62,29.59 74.62,29.25 74.5,29.14 74.5,28.59 74.89,28.21 75.28,28.21 75.51,27.98 75.51,21.92 73.61,20.02 73.61,18.34 73.36,18.09 73.36,17.54 73.74,17.16 74.29,17.16 74.44,17.31 75.54,17.31 | J4.1 75.54,17.31 | 75.54,17.31 75.54,10.32 v74.14,8.93
  Bottom 0.254: K3.1 74.13,8.94 v74.14,8.93 | v42.9,30.9 IC1.14
IO1_3  (via drill 0.35)
  Top 0.254: v41.38,31.79 40.74,31.15 v30.45,31.15
  Bottom 0.254: IC1.16 41.78,32.19 v41.38,31.79 40.36,31.79 33.38,38.77 J5.1 | v30.45,31.15 28.6,31.15 K0.1
IO1_4  (via drill 0.35)
  Top 0.254: v47.35,35.49 47.09,35.24 42.18,35.24 40.66,36.76 29.78,36.76 28.38,35.37 28.02,35.37 27.64,34.98 27.64,34.44 27.89,34.18 27.89,17.8 28.28,17.41 28.68,17.41 28.82,17.41 29.97,17.41 30.07,17.31 | J6.1 30.07,17.31 | 30.07,17.31 30.07,11.21 v30.45,10.83
  Bottom 0.254: IC1.17 46.12,32.84 47.35,34.07 v47.35,35.49 | v30.45,10.83 28.6,10.83 K1.1
IO1_5  (via drill 0.35)
  Top 0.254: v41.38,33.06 42.14,32.29 42.14,30.52 42.52,30.14 51.28,30.14 52.3,29.12 52.3,19.34 | v53.06,10.83 52.3,11.59 52.3,19.34 | J7.1 52.43,19.21 52.3,19.34
  Bottom 0.254: IC1.18 44.55,33.49 43.67,32.6 41.83,32.6 v41.38,33.06 | v53.06,10.83 51.33,10.83 K2.1
IO1_6  (via drill 0.35)
  Top 0.254: v75.16,28.87 75.16,29.63 72.77,32.02 | J8.1 75.67,34.77 74.93,34.03 74.93,33.67 74.54,33.29 74.19,33.29 72.91,32.02 72.77,32.02 | v42.9,34.07 43.26,34.43 51.05,34.43 51.77,33.71 51.77,33.42 52.15,33.03 52.51,33.03 53.53,32.02 72.77,32.02
  Bottom 0.254: K4.1 74.26,29.76 v75.16,28.87 | IC1.19 44.99,34.07 v42.9,34.07
LPF_IN1
  Bottom 0.254: K4.4 66.66,31.67 67.54,32.55 77.56,32.55 C51.1 77.95,32.66 L51.CB
LPF_IN2
  Bottom 0.254: K2.4 43.67,11.98 44.42,12.74 54.98,12.74 C31.1 55.73,13.48 L31.CB
LPF_IN3
  Bottom 0.254: C41.1 77.43,12.47 | K3.4 66.53,12.24 67.16,12.86 76.79,12.86 C41.1 | L41.CB 77.19,14.39 C41.1
LPF_IN6
  Bottom 0.254: K0.4 20.69,32.18 21.06,32.55 32.22,32.55 C1.1 32.49,32.53 L1.CB
LPF_IN7
  Bottom 0.254: K1.4 20.94,11.73 21.82,12.61 31.99,12.61 C11.1 32.23,14.77 L11.CB
LPF_OUT1
  Bottom 0.152: 66.66,37.32 K4.5
  Bottom 0.254: L52.CA 65.9,43.58 C54.2 | C55.1 73.78,39.15 L52.CA | L52.CA 69.98,38.8 68.13,38.8 66.66,37.32
LPF_OUT2
  Bottom 0.254: C35.1 50.14,22.52 47.6,19.98 | 47.6,19.98 L32.CA 45.44,19.85 43.67,18.08 K2.5 | C34.2 43.04,24.53 47.6,19.98
LPF_OUT3
  Bottom 0.254: K3.5 66.53,17.95 68.43,19.85 L42.CA | C44.2 65.52,24.4 L42.CA | L42.CA 72.75,22.52 C45.1
LPF_OUT6
  Bottom 0.254: C5.1 28.06,42.2 25.01,39.15 L2.CA 20.82,39.15 20.56,38.9 | C4.2 20.44,38.77 20.56,38.9 | 20.56,38.9 20.56,36.66 K0.5
LPF_OUT7
  Bottom 0.254: L12.CA 20.31,24.4 C14.2 | K1.5 20.94,18.33 22.45,19.85 L12.CA | L12.CA 26.79,19.85 29.45,22.52 C15.1
N$1
  Bottom 0.254: CO22.1 CO21.1 40.11,40.44 L1.CA
N$2
  Bottom 0.254: CO21.2 CO22.2 35.3,43.47 33.01,43.47 C3.1 27.15,44.61 L2.CB 24.74,47.03 C4.1
N$3
  Bottom 0.254: C122.1 C121.1 40.11,20.75 L11.CA
N$4
  Bottom 0.254: C14.1 24.61,27.72 L12.CB 29.07,27.47 C13.1 32.88,23.66 34.92,23.66 C122.2 C121.2
N$5
  Top 0.254: R15.1 28.56,7.3 25.39,7.3 25.15,7.06 25.15,6.41 24.6,5.86 23.78,5.86 23.36,6.28 23.36,11.7 14.83,20.23 12.17,20.23 | 12.17,20.23 DM3.A | IC2.1 12.17,25.33 12.17,20.23
N$6
  Top 0.254: IC2.7 13.31,30.52 | 13.31,30.52 13.31,30.39 11.02,28.1 8.1,28.1 7.09,29.12 DM4.A | 13.31,30.52 15.31,28.51 19.13,28.51 19.3,28.35 19.3,27.02 19.13,26.85 17.94,26.85 17.74,26.65 17.74,25.31 24.6,18.44 24.6,12.71 31.96,5.35 31.96,4.12 31.13,3.29 RM16.1
N$7
  Bottom 0.152: IC1.1 52.66,37.39 R1.1
N$8
  Bottom 0.254: C6.1 J9.13
N$9
  Top 0.254: R4M.2 RM3.2 | RM3.2 15.85,8.29 15.98,8.42 15.98,8.16 RM3.2 | 14.83,14.51 JX7.1 | 14.83,14.51 12.04,14.51 JX3.1 9.88,16.29 7.09,13.5 DM1.A | RM3.2 15.21,8.68 15.21,14.13 14.83,14.51
N$10
  Top 0.254: DM2.A 10.9,49.95 RM6.2 RM5.2
  Bottom 0.254: JX8.1 12.17,46.14 DM2.A
N$11
  Bottom 0.254: C422.1 C421.1 85.45,20.63 L41.CA
N$12
  Top 0.254: RM10.2 CM3.1 18.94,10.67 DM1.C
N$13
  Top 0.254: RM9.2 CM4.1 18.94,47.83 DM2.C
N$16
  Top 0.254: RM13.2 14.03,27.68 13.3,26.95 IC2.2 13.3,23.16 16.23,20.23 DM3.C
N$17
  Top 0.254: DM4.C 17.25,36.1 14.58,33.44 IC2.6 14.58,30.39 15.3,29.67 RM14.2
N$19
  Top 0.254: IC2.3 14.57,22.91 15.85,21.63 18.52,21.63 19.15,20.99 19.15,19.59 18.52,18.96 18.52,17.31 24.19,11.63 RM8.2
N$20
  Top 0.254: RM7.2 24.19,49.65 19.66,45.12 19.66,37.25 15.85,33.44 IC2.5
N$21
  Top 0.152: CM6.1 RM9.1
  Top 0.254: RM7.1 22.49,52.74 | 22.49,52.74 CM6.1 | 22.49,52.74 23.51,52.74 23.53,52.72 25.78,52.72 RM12.2
N$22
  Top 0.152: RM10.1 CM5.1
  Top 0.254: RM8.1 CM5.1 23.38,5.37 25.67,5.37 RM11.2
N$23
  Bottom 0.254: C44.1 69.95,27.6 L42.CB 72.75,24.8 C43.1 76.95,25.33 77.83,26.2 80.1,26.2 81,25.29 C422.2 C421.2
N$27
  Bottom 0.254: C322.1 C321.1 63.35,19.74 L31.CA
N$28
  Bottom 0.254: C34.1 47.35,27.6 L32.CB 50.14,24.8 C33.1 53.84,25.58 54.2,25.94 57.51,25.94 58.01,25.44 C322.2 C321.2
N$49
  Bottom 0.254: C522.1 C521.1 85.57,40.69 L51.CA
N$50
  Bottom 0.254: C521.2 C522.2 79.84,46.01 77.83,46.01 76.83,45.01 C53.1 72.49,44.61 L52.CB 68.16,46.77 C54.1
PC4_SDA  (via drill 0.35)
  Top 0.254: J3.12 53.95,38.52 42.94,38.52 v42.92,38.54
  Bottom 0.254: v42.92,38.54 42.92,38.25 44.43,36.74 IC1.23
PC5_SCL  (via drill 0.35)
  Top 0.254: J3.13 54.74,36.76 42.93,36.76 v42.9,36.74
  Bottom 0.254: IC1.22 44.44,36.09 43.79,36.74 v42.9,36.74
RX_RF
  Bottom 0.254: K1.3 23.14,9.51 23.47,9.18 43.92,9.18 | 43.92,9.18 45.06,9.18 45.87,9.99 | 45.87,9.99 45.87,9.94 46.63,9.18 68.05,9.18 68.73,9.87 K3.3 68.73,9.89 69.44,9.18 72.96,9.18 73.87,8.27 74.41,8.27 75.2,9.05 82.31,9.05 86.63,13.37 86.62,25.53 84.43,27.72 77.44,27.72 | 45.87,9.99 K2.3 | K0.3 22.89,29.58 23.47,28.99 67.67,28.99 68.86,30.19 K4.3 68.86,30.34 70.56,28.64 71.48,27.72 77.44,27.72 | 43.92,9.18 43.41,8.67 C6.2 | Q3.3 Q2.3 Q1.3 47.73,41.95 48.87,40.8 53.31,40.8 54.01,40.1 54.01,35.15 L80.CB 57.25,38.39 63.98,38.39 65.51,36.87 65.51,35.6 66.01,35.09 67.41,35.09 67.79,35.47 67.79,37.25 68.3,37.76 74.65,37.76 74.69,37.72 74.65,37.72 76.26,36.1 78.84,36.1 79.35,35.6 79.35,29.63 77.44,27.72
SWR_METER
  Bottom 0.254: K0.6 22.89,34.38 | 22.89,34.38 22.33,33.82 19.02,33.82 | 19.02,33.82 5.82,33.82 4.55,35.09 4.55,40.17 6.07,41.69 JX2.1 | 19.02,33.82 19.02,15.66 20.04,14.64 22.58,14.64 23.14,15.2 K1.6 23.14,15.23 23.85,14.51 29.57,14.51 31.85,16.8 35.79,16.8 39.09,13.5 41.88,13.5 43.15,14.77 45.57,14.77 45.87,15.07 K2.6 45.87,15.1 46.33,14.64 52.81,14.64 54.71,16.55 58.27,16.55 61.32,13.5 64.36,13.5 65.51,14.64 68.17,14.64 68.73,15.2 K3.6 | 22.89,34.38 23.04,34.38 23.72,33.69 28.55,33.69 31.22,36.36 33.63,36.36 40.49,29.5 58.78,29.5 60.68,31.41 65.13,31.41 68.86,35.14 K4.6
VCC
  Top 0.254: J3.6 51.92,55.03 18.52,55.03 17.63,54.14 17.63,48.55 16.87,47.79 16.23,47.79 15.21,46.77 15.21,45.63 16.1,44.74 16.99,44.74 18.39,43.34 18.39,40.8 16.99,39.41 13.31,39.41 12.04,38.14 IC2.8 9.9,31.77 CM1.1
  Bottom 0.254: C2.2 45.44,40.69 45.44,46.01 46.46,47.03 51.79,47.03 53.57,48.8 J3.6 | C2.2 45.06,37.74 IC1.24 | R1.2 51.24,39.37 50.27,38.39 47.47,38.39 46.72,39.14 C2.2

### Text on the board
tNames: GND | RST | MOSI | MISO | SCK | VCC | DRIVE | AREF | ADC0 | ADC1 | ADC3 | SDA | SCL | GND | ADC7 | ADC6 | GND | RX_RF | AIN1 | AIN0 | T1 | XCK | +12V | +12V | INT1 | INT0 | TXD | RXD | AUDIO | GND
bNames: GND | RST | MOSI | MISO | SCK | VCC | DRIVE | AREF | ADC0 | ADC1 | ADC3 | SDA | SCL | GND | 1 Turn | 1 Turn | 10 Turns | 10 Turns | BN-43-202 | ADC7 | ADC6 | GND | AIN1 | AIN0 | T1 | XCK | +12V | +12V | INT1 | INT0 | TXD | RXD | AUDIO | GND
tValues: K1FM | DL2MAN RF Board v3 Compatible / Rev. A